# Altium schematic sheet Quad-Stage-Prototype_FPGA_V1.0.SchDoc: Quad Stage Prototype
size A4; PageSetup: Record=PageOptions|CenterHorizontal=True|CenterVertical=True|PrintScale=0.97|XCorrection=1.00|YCorrection=1.00|PrintKind=0|BorderSize=5000000|LeftOffset=0|BottomOffset=0|Orientation=2|PaperLength=1000|PaperWidth=1000|Scale=100|PaperSource=7|PrintQuality=-3|MediaType=1|DitherType=10|PrintScaleMode=1|PaperKind=A4|PaperIndex=9; Organization: Ostschweizer Fachhochschule; Address2: Florian Baumgartner & Thierry Schwaller; Address3: florian.baumgartner@ost.ch; DocumentNumber: 3; Revision: V1.0; SheetNumber: 3; SheetTotal: 5; Author: Florian Baumgartner & Thierry Schwaller; Subtitle: FPGA
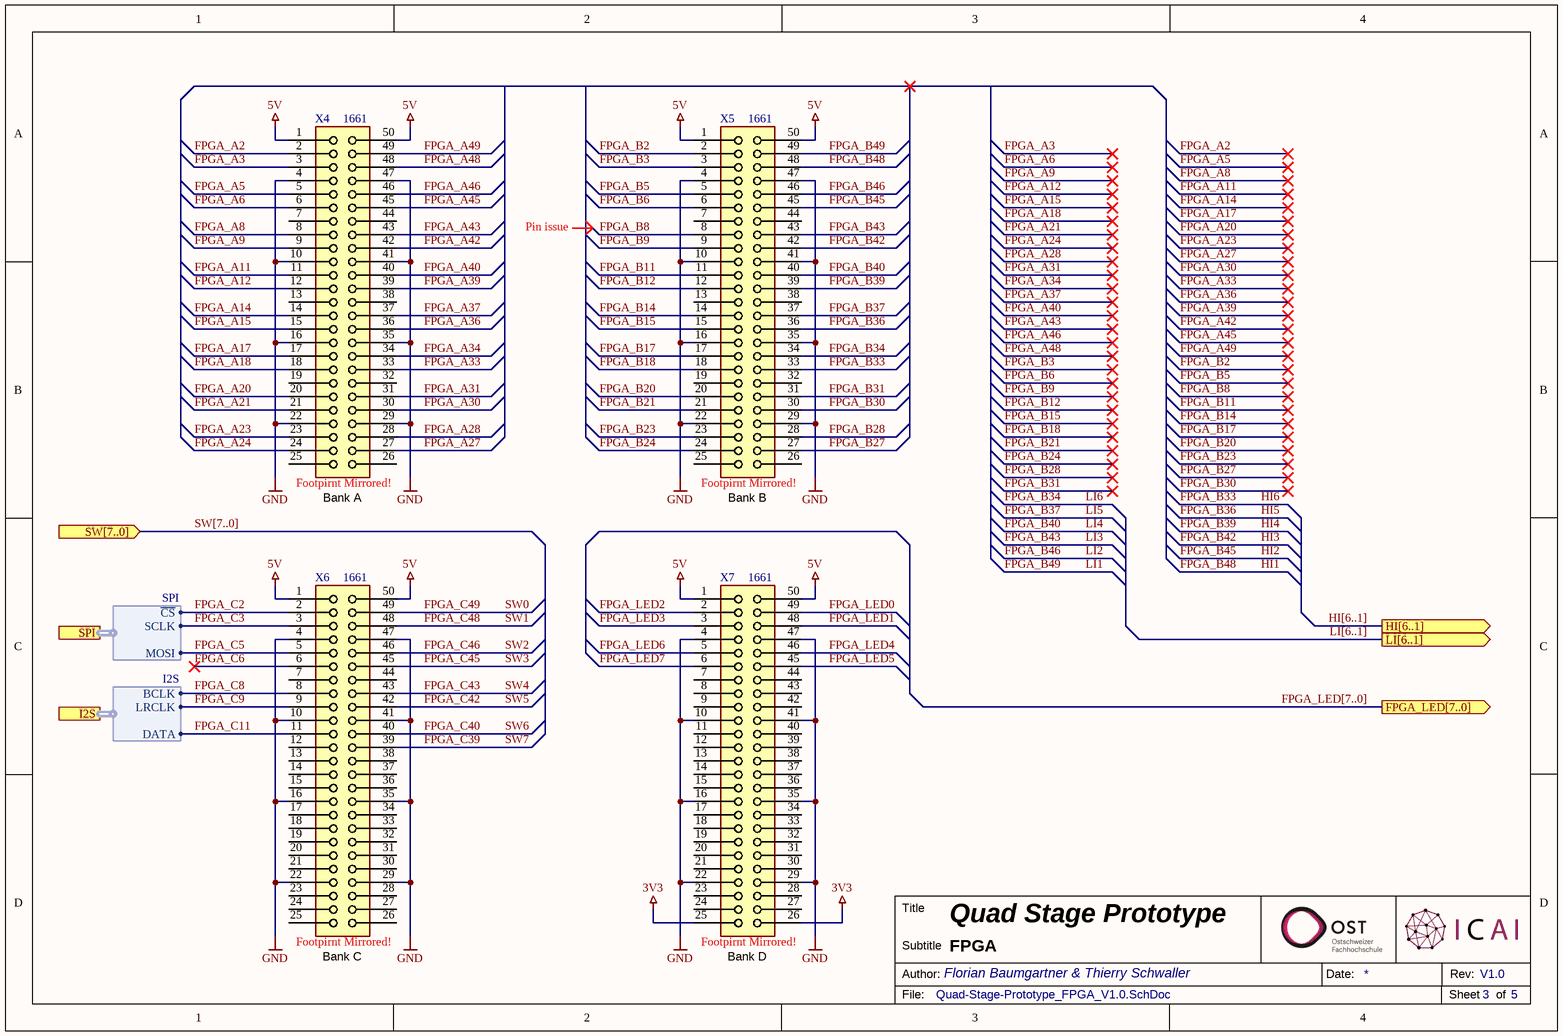
[diagram p0: Quad-Stage-Prototype_FPGA_V1.0.SchDoc]

## Parts
X4  1661  [SMD Connector (1661)]
X5  1661  [SMD Connector (1661)]
X6  1661  [SMD Connector (1661)]
X7  1661  [SMD Connector (1661)]

## Ports
FPGA_LED[7..0] (out), HI[6..1] (out), I2S (harness I2S), LI[6..1] (out), SPI (harness SPI), SW[7..0] (in)

## Harnesses
SPI: SCLK, MOSI, ~{CS}
I2S: BCLK, LRCLK, DATA

## Nets
3V3: X7.25 X7.26
5V: X4.1 X4.50 X5.1 X5.50 X6.1 X6.50 X7.1 X7.50
GND: X4.4 X4.10 X4.16 X4.22 X4.29 X4.35 X4.41 X4.47 X5.4 X5.10 X5.16 X5.22 X5.29 X5.35 X5.41 X5.47 X6.4 X6.10 X6.16 X6.22 X6.29 X6.35 X6.41 X6.47 X7.4 X7.10 X7.16 X7.22 X7.29 X7.35 X7.41 X7.47
FPGA_A2: X4.2
FPGA_A3: X4.3
FPGA_A5: X4.5
FPGA_A6: X4.6
FPGA_A8: X4.8
FPGA_A9: X4.9
FPGA_A11: X4.11
FPGA_A12: X4.12
FPGA_A14: X4.14
FPGA_A15: X4.15
FPGA_A17: X4.17
FPGA_A18: X4.18
FPGA_A20: X4.20
FPGA_A21: X4.21
FPGA_A23: X4.23
FPGA_A24: X4.24
FPGA_A27: X4.27
FPGA_A28: X4.28
FPGA_A30: X4.30
FPGA_A31: X4.31
FPGA_A33: X4.33
FPGA_A34: X4.34
FPGA_A36: X4.36
FPGA_A37: X4.37
FPGA_A39: X4.39
FPGA_A40: X4.40
FPGA_A42: X4.42
FPGA_A43: X4.43
FPGA_A45: X4.45
FPGA_A46: X4.46
FPGA_A48: X4.48
FPGA_A49: X4.49
FPGA_B2: X5.2
FPGA_B3: X5.3
FPGA_B5: X5.5
FPGA_B6: X5.6
FPGA_B8: X5.8
FPGA_B9: X5.9
FPGA_B11: X5.11
FPGA_B12: X5.12
FPGA_B14: X5.14
FPGA_B15: X5.15
FPGA_B17: X5.17
FPGA_B18: X5.18
FPGA_B20: X5.20
FPGA_B21: X5.21
FPGA_B23: X5.23
FPGA_B24: X5.24
FPGA_B27: X5.27
FPGA_B28: X5.28
FPGA_B30: X5.30
FPGA_B31: X5.31
FPGA_B33: X5.33  [also labelled HI6]
FPGA_B34: X5.34  [also labelled LI6]
FPGA_B36: X5.36  [also labelled HI5]
FPGA_B37: X5.37  [also labelled LI5]
FPGA_B39: X5.39  [also labelled HI4]
FPGA_B40: X5.40  [also labelled LI4]
FPGA_B42: X5.42  [also labelled HI3]
FPGA_B43: X5.43  [also labelled LI3]
FPGA_B45: X5.45  [also labelled HI2]
FPGA_B46: X5.46  [also labelled LI2]
FPGA_B48: X5.48  [also labelled HI1]
FPGA_B49: X5.49  [also labelled LI1]
FPGA_C2: X6.2 ; port SPI.~{CS}
FPGA_C3: X6.3 ; port SPI.SCLK
FPGA_C5: X6.5 ; port SPI.MOSI
FPGA_C6: X6.6
FPGA_C8: X6.8 ; port I2S.BCLK
FPGA_C9: X6.9 ; port I2S.LRCLK
FPGA_C11: X6.11 ; port I2S.DATA
FPGA_C39: X6.39  [also labelled SW7]
FPGA_C40: X6.40  [also labelled SW6]
FPGA_C42: X6.42  [also labelled SW5]
FPGA_C43: X6.43  [also labelled SW4]
FPGA_C45: X6.45  [also labelled SW3]
FPGA_C46: X6.46  [also labelled SW2]
FPGA_C48: X6.48  [also labelled SW1]
FPGA_C49: X6.49  [also labelled SW0]
FPGA_LED0: X7.49
FPGA_LED1: X7.48
FPGA_LED2: X7.2
FPGA_LED3: X7.3
FPGA_LED4: X7.46
FPGA_LED5: X7.45
FPGA_LED6: X7.5
FPGA_LED7: X7.6

Not connected (* = marked no-connect by the designer): X4 7 13 19 25 26 32 38 44; X5 7 13 19 25 26 32 38 44; X6 7 12 13 14 15 17 18 19 20 21 23 24 25 26 27 28 30 31 32 33 34 36 37 38 44; X7 7 8 9 11 12 13 14 15 17 18 19 20 21 23 24 27 28 30 31 32 33 34 36 37 38 39 40 42 43 44

## Buses and harness runs
bus FPGA_LED[7..0] = port FPGA_LED[7..0]
bus HI[6..1] = port HI[6..1]
bus LI[6..1] = port LI[6..1]
bus SW[7..0] = port SW[7..0]

## Notes on the sheet
- Pin issue
- (near X4) Footpirnt Mirrored!
- (near X4) Bank A
- (near X5) Footpirnt Mirrored!
- (near X5) Bank B
- (near X6) Footpirnt Mirrored!
- (near X6) Bank C
- (near X7) Footpirnt Mirrored!
- (near X7) Bank D
- Title
- Author:
- Subtitle
- Date:
- Rev:
- File:
- Sheet
- of

## Library data of the parts
X4-X7 = X-4UCON_1661: Board-to-Board Connector (Receptacle); Component Value: PRT-16890 (1661); Digikey: 1568-PRT-16890-ND; Mouser: 474-PRT-16890; ComponentLink1Description: Datasheet; ComponentLink1URL: http://www.4uconnector.com/online/object/4udrawing/19008.pdf; Component Description: Board-to-Board Connector (Receptacle); Unit Price: 1.60